# Altium schematic sheet Schematic.SchDoc
size A4; SheetNumber: 1; SheetTotal: 1
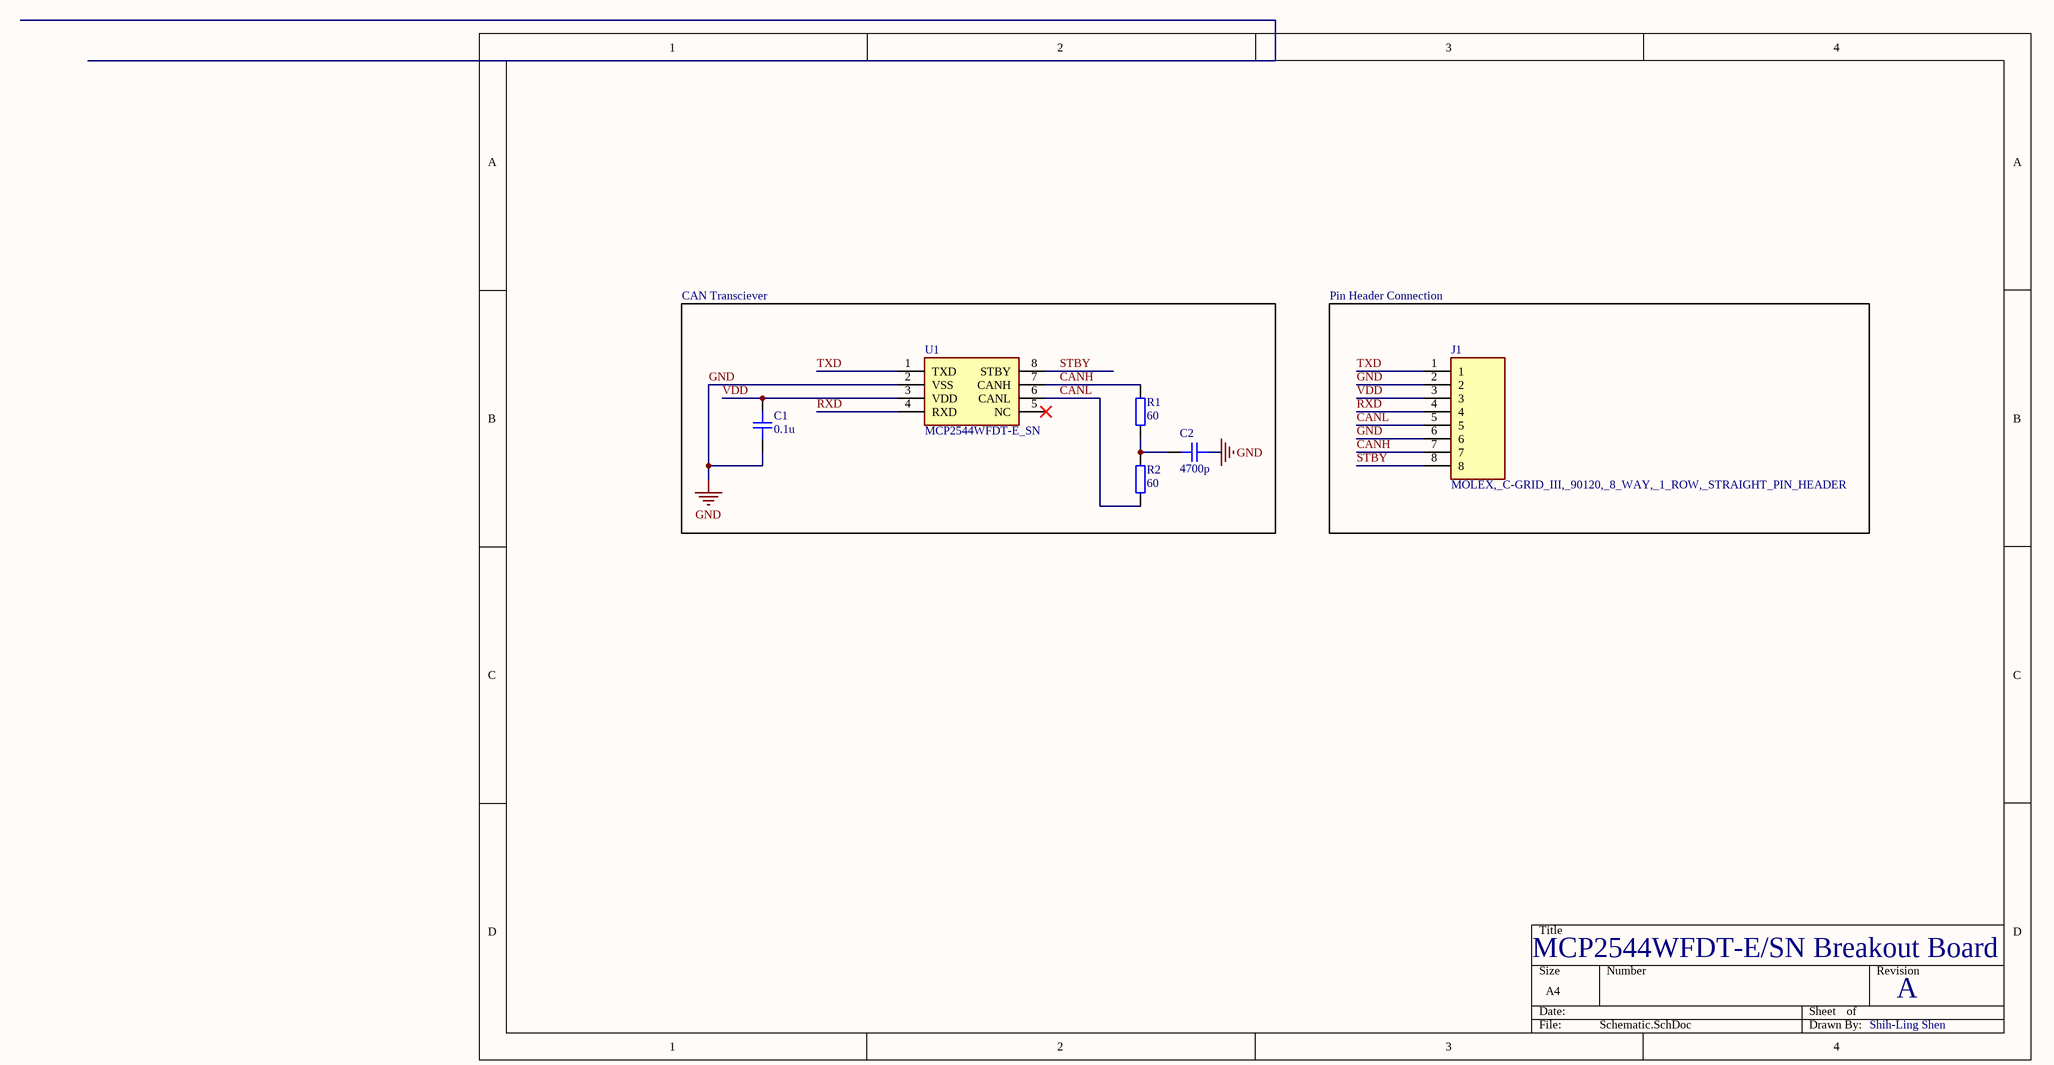
[diagram p0: Schematic.SchDoc]

## Parts
C1  0.1u  [CAP_0402]
C2  4700p  [CAP_0402]
J1  MOLEX,_C-GRID_III,_90120,_8_WAY,_1_ROW,_STRAIGHT_PIN_HEADER  [HDRV8W65P0X254_1X8_2010X249X945P]
R1  60  [RES_0805]
R2  60  [RES_0805]
U1  MCP2544WFDT-E_SN  [SOIC127P600X175-8N]

## Blocks framed on the sheet
CAN Transciever: C1 C2 R1 R2 U1
Pin Header Connection: J1

## Nets
GND: C1.2 C2.2 J1.2 J1.6 U1.2(VSS)
CANH: J1.7 R1.2 U1.7(CANH)
CANL: J1.5 R2.1 U1.6(CANL)
RXD: J1.4 U1.4(RXD)
STBY: J1.8 U1.8(STBY)
TXD: J1.1 U1.1(TXD)
VDD: C1.1 J1.3 U1.3(VDD)
NetC2_1: C2.1 R1.1 R2.2

Not connected (* = marked no-connect by the designer): U1 5(NC)*

## Notes on the sheet
- MCP2544WFDT-E/SN Breakout Board
- A
- Shih-Ling Shen

## Library data of the parts
C1 C2 = CAP_0402_10V: Capacitor SMD 0402 10V
J1 = MOLEX,_C-GRID_III,_90120,_8_WAY,_1_ROW,_STRAIGHT_PIN_HEADER: Connector; Datasheet Link: https://www.molex.com/pdm_docs/sd/901200128_sd.pdf; Height: 9.45mm; Manufacturer_Name: Molex; Manufacturer_Part_Number: MOLEX
R1 R2 = RES_0805: Resistor SMD 0805; Manufacturer: *; Manufacturer Part Number: *; Distributor Link: *
U1 = MCP2544WFDT-E_SN: Integrated Circuit; Manufacturer_Name: Microchip; Manufacturer_Part_Number: MCP2544WFDT-E/SN; Datasheet Link: https://ww1.microchip.com/downloads/aemDocuments/documents/APID/ProductDocuments/DataSheets/MCP2542FD-MCP2542WFD-4WFD-Data-Sheet-DS20005514C.pdf; Height: 1.75mm; Mouser Part Number: 579-MCP2544WFDT-E/SN; Mouser Price/Stock: https://www.mouser.co.uk/ProductDetail/Microchip-Technology-Atmel/MCP2544WFDT-E-SN?qs=qdgZG5p0FZ4T7O4Xjw%2FO1Q%3D%3D; Arrow Part Number: MCP2544WFDT-E/SN; Arrow Price/Stock: https://www.arrow.com/en/products/mcp2544wfdt-esn/microchip-technology?region=nac